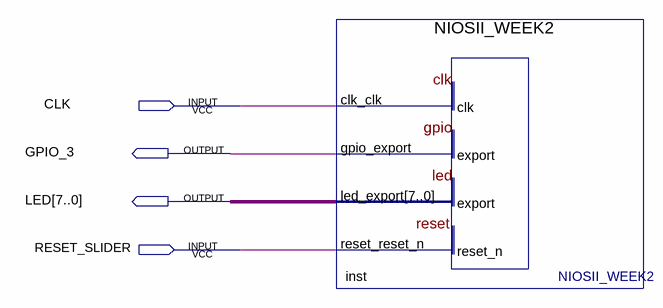
[diagram p0: schematic sheet]
// Quartus schematic Lab2_project.bdf as structural Verilog: 1 symbols, 4 pins
module Lab2_project (
  input  CLK,
  input  RESET_SLIDER,
  output GPIO_3,
  output [7:0] LED
);

  NIOSII_WEEK2 inst (.clk_clk(CLK), .reset_reset_n(RESET_SLIDER), .gpio_export(GPIO_3), .led_export(LED));
endmodule
